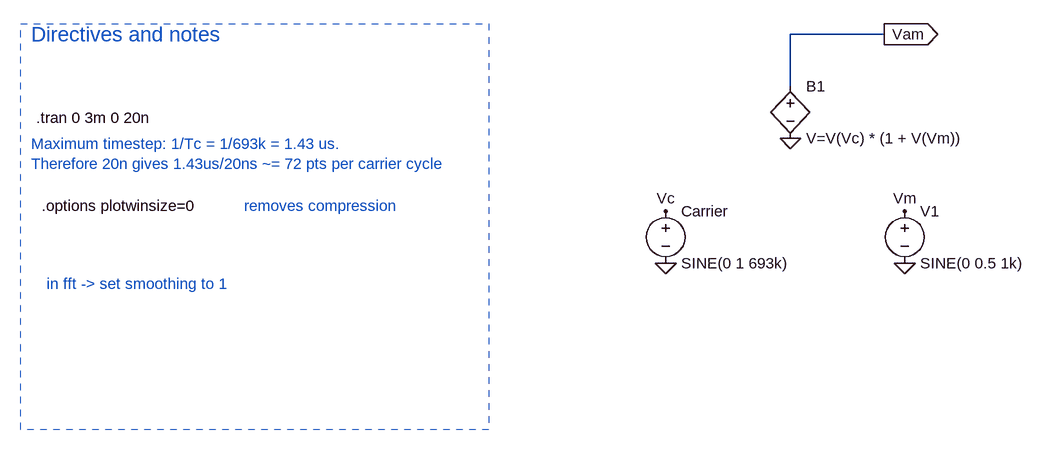
[diagram p0: schematic am-source.asc]
am-source.asc, the LTspice schematic file:
Version 4.1
SHEET 1 1364 680
WIRE 464 -128 320 -128
WIRE 320 -48 320 -128
FLAG 128 224 0
FLAG 128 144 Vc
FLAG 496 144 Vm
FLAG 496 224 0
FLAG 320 32 0
FLAG 464 -128 Vam
IOPIN 464 -128 Out
SYMBOL voltage 128 128 R0
WINDOW 123 0 0 Left 0
WINDOW 39 0 0 Left 0
SYMATTR InstName Carrier
SYMATTR Value SINE(0 1 693k)
SYMBOL bv 320 -64 R0
SYMATTR InstName B1
SYMATTR Value V=V(Vc) * (1 + V(Vm))
SYMBOL voltage 496 128 R0
WINDOW 123 0 0 Left 0
WINDOW 39 0 0 Left 0
SYMATTR InstName V1
SYMATTR Value SINE(0 0.5 1k)
TEXT -840 0 Left 2 !.tran 0 3m 0 20n
TEXT -848 40 Left 2 ;Maximum timestep: 1/Tc = 1/693k = 1.43 us. \nTherefore 20n gives 1.43us/20ns ~= 72 pts per carrier cycle
TEXT -832 136 Left 2 !.options plotwinsize=0
TEXT -848 -128 Left 3 ;Directives and notes
TEXT -520 136 Left 2 ;removes compression
TEXT -824 256 Left 2 ;in fft -> set smoothing to 1
RECTANGLE Normal -144 480 -864 -144 2

The netlist it stands for:
* am-source.asc
V§Carrier Vc 0 SINE(0 1 693k)
B1 Vam 0 V=V(Vc) * (1 + V(Vm))
V1 Vm 0 SINE(0 0.5 1k)
.tran 0 3m 0 20n
* Maximum timestep: 1/Tc = 1/693k = 1.43 us.
* Therefore 20n gives 1.43us/20ns ~= 72 pts per carrier cycle
.options plotwinsize=0
* Directives and notes
* removes compression
* in fft -> set smoothing to 1
.backanno
.end